# EAGLE design br44 (EAGLE 9.4.0)
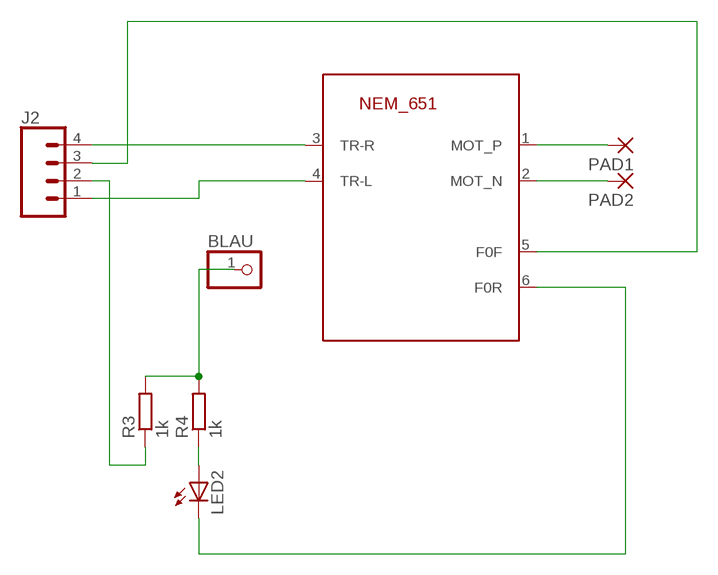
[diagram p0: schematic, sheet 1]

## Parts
BLAU  PINHD-1X1  [1X01]
J2  CONN_041X04_NO_SILK  [1X04_NO_SILK]
LED2  LED3MM  [LED3MM]
PAD1  SMD5  [SMD2,54-5,08]
PAD2  SMD5  [SMD2,54-5,08]
R3  1k  R-EU_0204/2V  [0204V]
R4  1k  R-EU_0204/2V  [0204V]
U$1  NEM_651-TS  [53047-06]

## Nets
N$1: PAD1.1(P) U$1.1(MOT_P)
N$2: PAD2.1(P) U$1.2(MOT_N)
N$3: J2.4 U$1.3(TR-R)
N$4: J2.1 U$1.4(TR-L)
N$5: BLAU.1 R3.2 R4.2
N$6: LED2.A R4.1
N$7: J2.2 R3.1
N$8: J2.3 U$1.5(F0F)
N$9: LED2.K(C) U$1.6(F0R)

## Library data of the parts
BLAU = adafruit:PINHD-1X1: Pin header 1x1 for 0.1" spacing With round pins
J2 = SparkFun-Connectors:CONN_04: Multi connection point. Often used as Generic Header-pin footprint for 0.1 inch spaced/style header connections On any of the 0.1 inch spaced packages, you can populate with these: Break Away Headers - Straight <https://www.sparkfun.com/products/116> (PRT-00116) Break Away Male Headers - Right Angle <https://www.sparkfun.com/products/553> (PRT-00553) Female Headers <https://www.sparkfun.com/products/115> (PRT-00115) Break Away Headers - Machine Pin <https://www.sparkfun.com/products/117> (PRT-00117) Break Away Female Headers - Swiss Machine Pin <https://www.sparkfun.com/products/743> (PRT-00743) For SCREWTERMINALS and SPRING TERMINALS visit here: Screw Terimnals on SparkFun.com <https://www.sparkfun.com/search/results?term=Screw+Terminals> (5mm/3.5mm/2.54mm spacing) This device is also useful as a general connection point to wire up your design to another part of your project. Our various solder wires solder well into these plated through hole pads. Hook-Up Wire - Assortment (Stranded, 22 AWG) <https://www.sparkfun.com/products/11375> (PRT-11375) Hook-Up Wire - Assortment (Solid Core, 22 AWG) <https://www.sparkfun.com/products/11367> (PRT-11367) View the entire wire category on our website here <https://www.sparkfun.com/categories/141> Special notes: Molex polarized connector foot print use with SKU : PRT-08231 with associated crimp pins and housings. 1MM SMD Version SKU: PRT-10208; PROD_ID: CONN-09696
LED2 = adafruit:LED: LED OSRAM: - CHIPLED LG R971, LG N971, LY N971, LG Q971, LY Q971, LO R971, LY R971 LH N974, LH R974 LS Q976, LO Q976, LY Q976 LO Q996 - Hyper CHIPLED LW Q18S LB Q993, LB Q99A, LB R99A - SideLED LS A670, LO A670, LY A670, LG A670, LP A670 LB A673, LV A673, LT A673, LW A673 LH A674 LY A675 LS A676, LA A676, LO A676, LY A676, LW A676 LS A679, LY A679, LG A679 - Hyper Micro SIDELED® LS Y876, LA Y876, LO Y876, LY Y876 LT Y87S - SmartLED LW L88C, LW L88S LB L89C, LB L89S, LG L890 LS L89K, LO L89K, LY L89K LS L896, LA L896, LO L896, LY L896 - TOPLED LS T670, LO T670, LY T670, LG T670, LP T670 LSG T670, LSP T670, LSY T670, LOP T670, LYG T670 LG T671, LOG T671, LSG T671 LB T673, LV T673, LT T673, LW T673 LH T674 LS T676, LA T676, LO T676, LY T676, LB T676, LH T676, LSB T676, LW T676 LB T67C, LV T67C, LT T67C, LS T67K, LO T67K, LY T67K, LW E67C LS E67B, LA E67B, LO E67B, LY E67B, LB E67C, LV E67C, LT E67C LW T67C LS T679, LY T679, LG T679 LS T770, LO T770, LY T770, LG T770, LP T770 LB T773, LV T773, LT T773, LW T773 LH T774 LS E675, LA E675, LY E675, LS T675 LS T776, LA T776, LO T776, LY T776, LB T776 LHGB T686 LT T68C, LB T68C - Hyper Mini TOPLED® LB M676 - Mini TOPLED Santana® LG M470 LS M47K, LO M47K, LY M47K Source: http://www.osram.convergy.de/
PAD1 PAD2 = wirepad:SMD5: SMD PAD
R3 R4 = rcl:R-EU_: RESISTOR, European symbol; SPICEPREFIX: R
U$1 = con-nem:NEM_651: NEM651 Decoder Plug

## Board
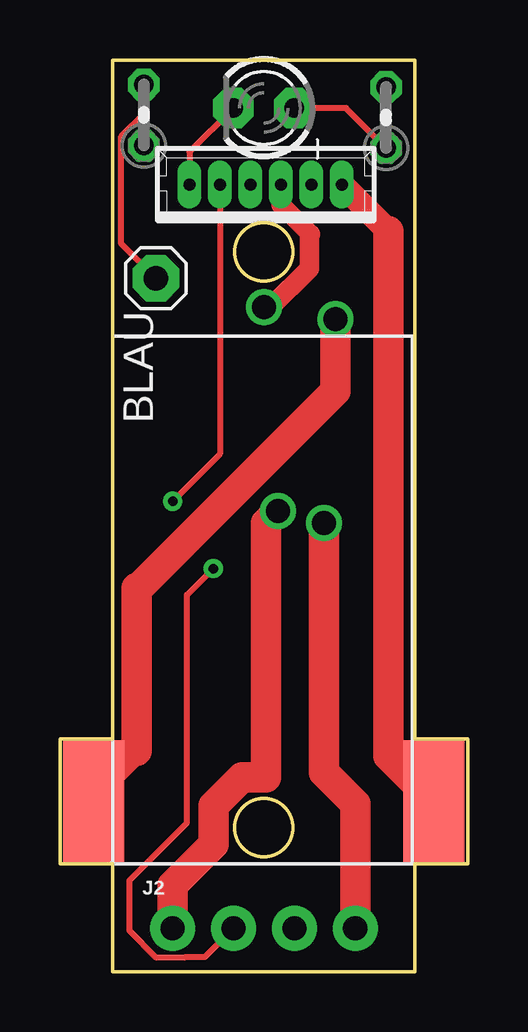
[diagram p1: board, top side]
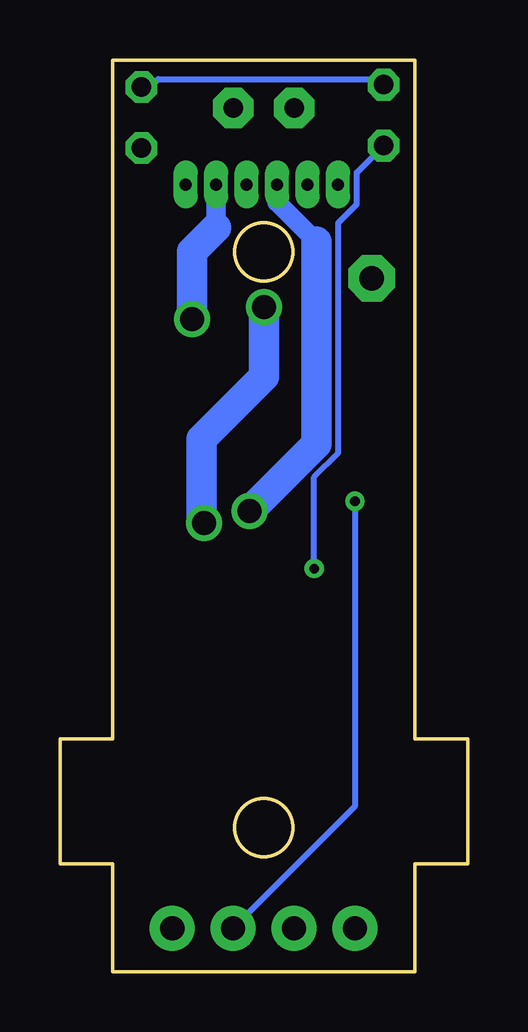
[diagram p2: board, bottom side, seen from below]

Size 17 x 38 mm. Coordinates in mm from the lower left corner, seen from the top.
Outline: 2.2,0 14.8,0 14.8,4.5 17,4.5 17,9.7 14.8,9.7 14.8,38 2.2,38 2.2,9.7 0,9.7 0,4.5 2.2,4.5 2.2,0
Outline: circle at 8.5,6 radius 1.2
Outline: circle at 8.5,30 radius 1.2
Copper layers (1*16): Top 0.035mm / dielectric 1.5mm / Bottom 0.035mm
Design rules "default *": minimum track width 6mil, minimum drill 0.35mm, track to track 6mil, track to pad 6mil, pad to pad 6mil, via to via 6mil, smd to smd 6mil, copper to edge 6mil, drill to drill 6mil, minimum pad ring 10mil, minimum via ring 8mil, stop-mask expansion 4mil, vias tented up to drill 0mil, thermal gap 10mil

### Footprints (pad centres in the part's own frame; a part is rotated, then mirrored left to right if it is on the bottom)
1X01 = drill 1.016 pad 1.93 octagon: 1 0,0
1X04_NO_SILK = drill 1.016 pad 1.88: 1 0,0; 2 2.54,0; 3 5.08,0; 4 7.62,0
LED3MM = drill 0.813 pad 1.676 octagon: A -1.27,0; K 1.27,0
SMD2,54-5,08 = smd 2.54 x 5.08: 1 0,0
0204V = drill 0.813 octagon: 1 -1.27,0; 2 1.27,0
53047-06 = drill 0.5 pad 0.698 long: 1 3.175,0; 2 1.905,0; 3 0.635,0; 4 -0.635,0; 5 -1.905,0; 6 -3.175,0

### Placement (x,y rotation side)
BLAU  4,28.9 0 top
J2  4.7,1.8 0 top
LED2  8.5,36 180 top
PAD1  15.6,7.1 0 top
PAD2  1.4,7.1 0 top
R3  3.5,35.7 90 top
R4  13.6,35.6 90 top
U$1  8.58,32.81 0 top

### Tracks (layer width: path | path; a pad name or v marks a point on that pad's centre or on a via)
N$1
  Top 1.016: 13.7,30.86 U$1.1
  Top 1.27: PAD1.1 13.7,9 13.7,30.86
N$2  (via drill 1)
  Top 1.016: 3.29,16 3.2,16 | 3.2,9.2 1.4,7.4 PAD2.1
  Top 1.27: 3.29,16 11.48,24.2 v11.48,27.2 | 3.2,16 3.2,9.2
  Bottom 0.813: U$1.2 10.48,31.01
  Bottom 1.27: 10.48,31.01 11.48,30.01 v11.48,27.2
N$3  (via drill 1)
  Top 0.813: U$1.3 9.22,32.8 9.22,31.97 10.45,30.74 10.41,30.7 10.41,29.31 8.79,27.69 v8.51,27.69 v8.5,27.7
  Top 1.27: v11,18.7 11,8.3 12.32,6.98 J2.4
  Bottom 1.016: 11.1,18.8 v11,18.7
  Bottom 1.27: v8.5,27.7 8.5,24.8 11.1,22.2 11.1,18.8
N$4  (via drill 1)
  Top 1.27: J2.1 4.7,3.6 6.4,5.3 6.4,6.9 7.58,8.08 8.6,8.08 8.6,18.7 v9.1,19.2
  Bottom 0.813: 6.3,30.43 7.94,32.07 7.94,32.8 U$1.4
  Bottom 1.27: 6.3,30.43 6.3,22 v9.1,19.2
N$5
  Top 0.254: R3.2 3.5,35.76 2.56,34.82 2.56,30.34 BLAU.1
  Bottom 0.254: R4.2 13.23,36.87 12.9,37.2 3.73,37.2 R3.2
N$6
  Top 0.254: R4.1 11.93,36 LED2.A
N$7  (via drill 0.4)
  Top 0.254: J2.2 6.04,0.6 5.22,0.6 5.21,0.58 4.02,0.58 2.9,1.7 2.9,3.8 5.3,6.2 5.3,15.7 v6.4,16.8
  Bottom 0.254: R3.1 4.62,33.31 4.62,31.98 5.39,31.22 5.39,21.62 6.4,20.61 v6.4,16.8
N$8  (via drill 0.4)
  Top 0.254: U$1.5 6.67,21.57 v4.7,19.6
  Bottom 0.254: J2.3 4.7,6.88 v4.7,19.6
N$9
  Top 0.254: LED2.K 5.41,34.17 U$1.6